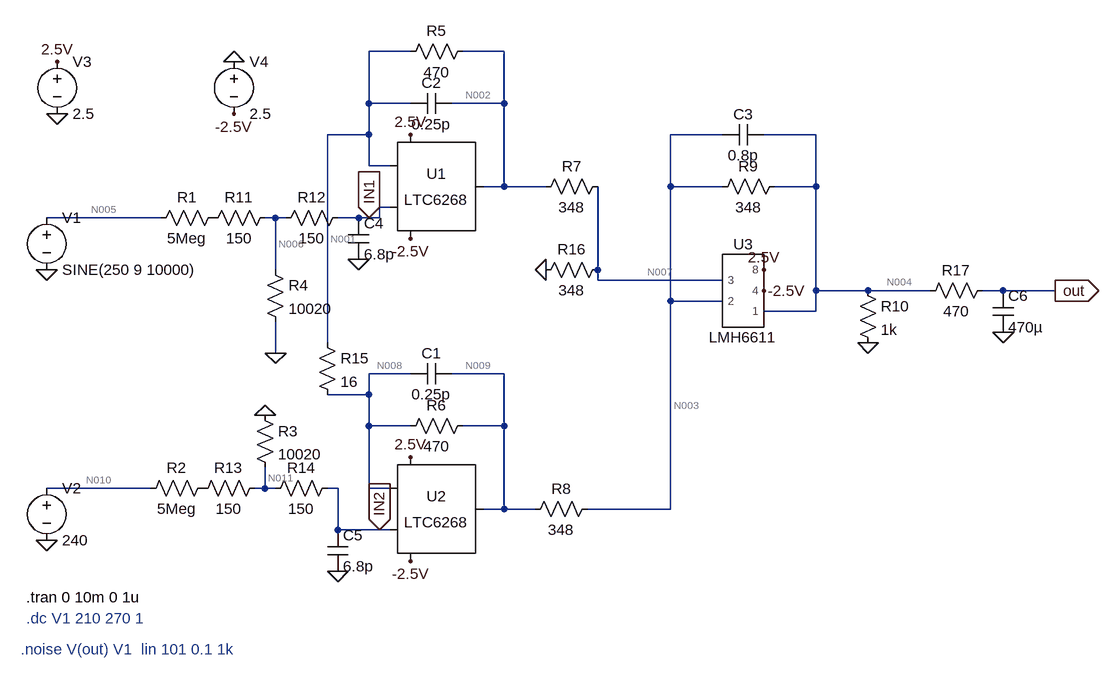
[diagram p0: schematic ltc6268_probe.asc]
ltc6268_probe.asc, the LTspice schematic file:
Version 4
SHEET 1 1632 792
WIRE 544 -144 480 -144
WIRE 688 -144 624 -144
WIRE 480 -64 480 -144
WIRE 544 -64 480 -64
WIRE 688 -64 688 -144
WIRE 688 -64 608 -64
WIRE 480 -16 480 -64
WIRE 480 -16 416 -16
WIRE 1024 -16 944 -16
WIRE 1168 -16 1088 -16
WIRE 480 32 480 -16
WIRE 512 32 480 32
WIRE 688 64 688 -64
WIRE 688 64 656 64
WIRE 752 64 688 64
WIRE 944 64 944 -16
WIRE 1024 64 944 64
WIRE 1168 64 1168 -16
WIRE 1168 64 1104 64
WIRE 512 96 496 96
WIRE 160 112 -16 112
WIRE 336 112 320 112
WIRE 352 112 336 112
WIRE 464 112 432 112
WIRE 480 112 464 112
WIRE 496 112 496 96
WIRE 496 112 480 112
WIRE 336 192 336 112
WIRE 832 192 832 64
WIRE 832 208 832 192
WIRE 1024 208 832 208
WIRE 1168 224 1168 64
WIRE 1248 224 1168 224
WIRE 1344 224 1248 224
WIRE 1456 224 1424 224
WIRE 1536 224 1456 224
WIRE 944 240 944 64
WIRE 1024 240 944 240
WIRE 1168 256 1168 224
WIRE 1168 256 1088 256
WIRE 416 304 416 -16
WIRE 336 320 336 272
WIRE 336 320 320 320
WIRE 544 352 480 352
WIRE 688 352 608 352
WIRE 480 384 480 352
WIRE 480 384 416 384
WIRE 480 432 480 384
WIRE 544 432 480 432
WIRE 688 432 688 352
WIRE 688 432 624 432
WIRE 144 528 -16 528
WIRE 320 528 320 496
WIRE 320 528 304 528
WIRE 336 528 320 528
WIRE 432 528 416 528
WIRE 480 528 480 432
WIRE 512 528 480 528
WIRE 688 560 688 432
WIRE 688 560 656 560
WIRE 736 560 688 560
WIRE 944 560 944 240
WIRE 944 560 816 560
WIRE 432 592 432 528
WIRE 496 592 432 592
WIRE 512 592 496 592
FLAG -16 192 0
FLAG -16 608 0
FLAG 0 -48 0
FLAG 272 -128 0
FLAG 0 -128 2.5V
FLAG 272 -48 -2.5V
FLAG 1248 304 0
FLAG 1536 224 out
IOPIN 1536 224 Out
FLAG 464 176 0
FLAG 432 656 0
FLAG 336 320 0
FLAG 320 416 0
FLAG 480 112 IN1
IOPIN 480 112 In
FLAG 496 592 IN2
IOPIN 496 592 In
FLAG 752 192 0
FLAG 1456 288 0
FLAG 544 -16 2.5V
FLAG 544 480 2.5V
FLAG 544 144 -2.5V
FLAG 544 640 -2.5V
FLAG 1088 192 2.5V
FLAG 1088 224 -2.5V
SYMBOL voltage -16 96 R0
WINDOW 123 24 124 Left 2
WINDOW 39 0 0 Left 0
SYMATTR InstName V1
SYMATTR Value SINE(250 9 10000)
SYMBOL voltage -16 512 R0
WINDOW 123 0 0 Left 0
WINDOW 39 0 0 Left 0
SYMATTR InstName V2
SYMATTR Value 240
SYMBOL res 256 96 R90
WINDOW 0 0 56 VBottom 2
WINDOW 3 32 56 VTop 2
SYMATTR InstName R1
SYMATTR Value 5Meg
SYMBOL res 240 512 R90
WINDOW 0 0 56 VBottom 2
WINDOW 3 32 56 VTop 2
SYMATTR InstName R2
SYMATTR Value 5Meg
SYMBOL OpAmps\\LTC6268 544 64 R0
SYMATTR InstName U1
SYMBOL OpAmps\\LTC6268 544 560 R0
SYMATTR InstName U2
SYMBOL voltage 0 -144 R0
SYMATTR InstName V3
SYMATTR Value 2.5
SYMBOL voltage 272 -144 R0
SYMATTR InstName V4
SYMATTR Value 2.5
SYMBOL res 304 400 R0
SYMATTR InstName R3
SYMATTR Value 10020
SYMBOL res 320 176 R0
SYMATTR InstName R4
SYMATTR Value 10020
SYMBOL res 640 -160 R90
WINDOW 0 0 56 VBottom 2
WINDOW 3 32 56 VTop 2
SYMATTR InstName R5
SYMATTR Value 470
SYMBOL res 640 416 R90
WINDOW 0 0 56 VBottom 2
WINDOW 3 32 56 VTop 2
SYMATTR InstName R6
SYMATTR Value 470
SYMBOL cap 608 336 R90
WINDOW 0 0 32 VBottom 2
WINDOW 3 32 32 VTop 2
SYMATTR InstName C1
SYMATTR Value 0.25p
SYMBOL cap 608 -80 R90
WINDOW 0 0 32 VBottom 2
WINDOW 3 32 32 VTop 2
SYMATTR InstName C2
SYMATTR Value 0.25p
SYMBOL res 848 48 R90
WINDOW 0 0 56 VBottom 2
WINDOW 3 32 56 VTop 2
SYMATTR InstName R7
SYMATTR Value 348
SYMBOL res 832 544 R90
WINDOW 0 0 56 VBottom 2
WINDOW 3 32 56 VTop 2
SYMATTR InstName R8
SYMATTR Value 348
SYMBOL res 1120 48 R90
WINDOW 0 0 56 VBottom 2
WINDOW 3 32 56 VTop 2
SYMATTR InstName R9
SYMATTR Value 348
SYMBOL cap 1088 -32 R90
WINDOW 0 0 32 VBottom 2
WINDOW 3 32 32 VTop 2
SYMATTR InstName C3
SYMATTR Value 0.8p
SYMBOL res 1232 208 R0
SYMATTR InstName R10
SYMATTR Value 1k
SYMBOL res 336 96 R90
WINDOW 0 0 56 VBottom 2
WINDOW 3 32 56 VTop 2
SYMATTR InstName R11
SYMATTR Value 150
SYMBOL res 448 96 R90
WINDOW 0 0 56 VBottom 2
WINDOW 3 32 56 VTop 2
SYMATTR InstName R12
SYMATTR Value 150
SYMBOL cap 448 112 R0
SYMATTR InstName C4
SYMATTR Value 6.8p
SYMBOL res 320 512 R90
WINDOW 0 0 56 VBottom 2
WINDOW 3 32 56 VTop 2
SYMATTR InstName R13
SYMATTR Value 150
SYMBOL res 432 512 R90
WINDOW 0 0 56 VBottom 2
WINDOW 3 32 56 VTop 2
SYMATTR InstName R14
SYMATTR Value 150
SYMBOL cap 416 592 R0
SYMATTR InstName C5
SYMATTR Value 6.8p
SYMBOL res 848 176 R90
WINDOW 0 0 56 VBottom 2
WINDOW 3 32 56 VTop 2
SYMATTR InstName R16
SYMATTR Value 348
SYMBOL res 400 288 R0
SYMATTR InstName R15
SYMATTR Value 16
SYMBOL res 1440 208 R90
WINDOW 0 0 56 VBottom 2
WINDOW 3 32 56 VTop 2
SYMATTR InstName R17
SYMATTR Value 470
SYMBOL cap 1440 224 R0
SYMATTR InstName C6
SYMATTR Value 470µ
SYMBOL LMH6611 1056 224 R0
SYMATTR InstName U3
TEXT -48 728 Left 2 ;.dc V1 210 270 1
TEXT -56 776 Left 2 ;.noise V(out) V1  lin 101 0.1 1k
TEXT -48 696 Left 2 !.tran 0 10m 0 1u

The netlist it stands for:
* ltc6268_probe.asc
V1 N005 0 SINE(250 9 10000)
V2 N010 0 240
R1 P001 N005 5Meg
R2 P002 N010 5Meg
XU1 IN1 N001 N002 2.5V -2.5V NC_01 LTC6268
XU2 IN2 N008 N009 2.5V -2.5V NC_02 LTC6268
V3 2.5V 0 2.5
V4 0 -2.5V 2.5
R3 0 N011 10020
R4 N006 0 10020
R5 N002 N001 470
R6 N009 N008 470
C1 N009 N008 0.25p
C2 N002 N001 0.25p
R7 N007 N002 348
R8 N003 N009 348
R9 N004 N003 348
C3 N004 N003 0.8p
R10 N004 0 1k
R11 N006 P001 150
R12 IN1 N006 150
C4 IN1 0 6.8p
R13 N011 P002 150
R14 IN2 N011 150
C5 IN2 0 6.8p
R16 N007 0 348
R15 N001 N008 16
R17 out N004 470
C6 out 0 470µ
XU3 N007 N003 2.5V -2.5V N004 LMH6611  ; pins 3 2 8 4 1
* .dc V1 210 270 1
* .noise V(out) V1  lin 101 0.1 1k
.tran 0 10m 0 1u
.lib LTC2.lib
.lib C:\Users\Klaud\Documents\Git Projects\esp-now-differential-probe\simluation\LMH6611.MOD
.backanno
.end

* Results of the author's LTspice run, read from the files saved beside the schematic
* Operating Point, zero values left out:
*   V(n005) = 250 V
*   V(n010) = 240 V
*   V(p001) = 507.5 mV
*   V(p002) = 487.2 mV
*   V(n001) = 500 mV
*   V(n002) = 1.085 V
*   V(-2.5v) = -2.5 V
*   V(2.5v) = 2.5 V
*   V(in1) = 500 mV
*   V(n008) = 480 mV
*   V(n009) = -105.5 mV
*   V(in2) = 480 mV
*   V(n011) = 480 mV
*   V(n006) = 500 mV
*   V(n007) = 541.7 mV
*   V(n003) = 541.7 mV
*   V(n004) = 1.191 V
*   V(out) = 1.191 V
*   I(R1) = -49.9 µA
*   I(R2) = -47.9 µA
*   I(R3) = -47.9 µA
*   I(R4) = 49.9 µA
*   I(R5) = 1.246 mA
*   I(R6) = -1.246 mA
*   I(R7) = -1.562 mA
*   I(R8) = 1.86 mA
*   I(R9) = 1.866 mA
*   I(R10) = 1.191 mA
*   I(R11) = -49.9 µA
*   I(R13) = -47.9 µA
*   I(R16) = 1.557 mA
*   I(R15) = 1.246 mA
*   I(V1) = -49.9 µA
*   I(V2) = -47.9 µA
*   I(V3) = -38.88 mA
*   I(V4) = -36.12 mA
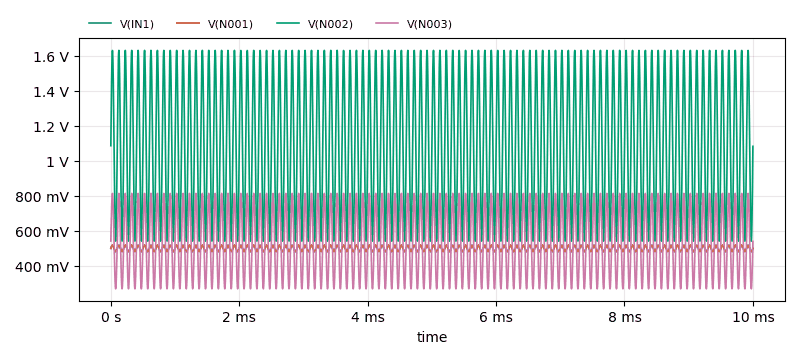
[diagram p1: Transient Analysis of ltc6268_probe.asc, plotted from the saved traces]
* Transient Analysis, 1 run:
*   V(IN1): min 482 mV, max 518 mV, average 500 mV, rms 500.1 mV, last 499.9 mV
*   V(N001): min 482 mV, max 517.9 mV, average 499.9 mV, rms 500.1 mV, last 499.9 mV
*   V(N002): min 541.1 mV, max 1.629 V, average 1.085 V, rms 1.151 V, last 1.082 V
*   V(N003): min 269.5 mV, max 813.7 mV, average 541.6 mV, rms 574.8 mV, last 540 mV